# Altium schematic sheet Deel_1_ATMEGA.SchDoc: Soldeerstation
size A4; CompanyName: PXL; DrawnBy: Kenneth Rennen; Revision: 1.0; SheetNumber: 1; SheetTotal: 5; Scheet of: 1/5; Number: PXL_1EAI_12102667
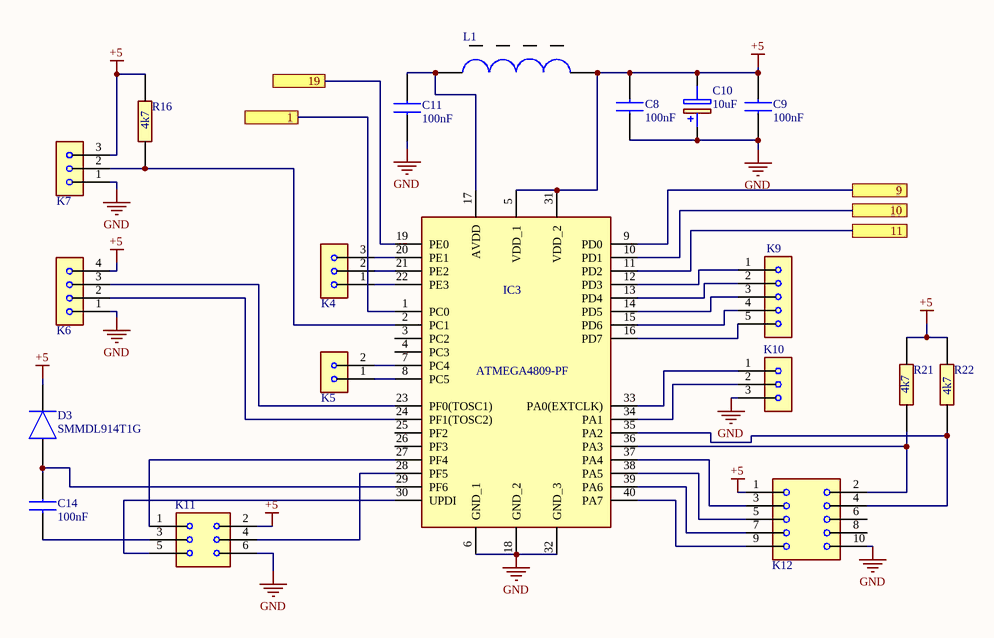
[diagram p0: Deel_1_ATMEGA.SchDoc]

## Parts
C8  100nF  [100nF]
C9  100nF  [100nF]
C10  10uF  [10uf]
C11  100nF  [100nF]
C14  100nF  [100nF]
D3  SMMDL914T1G  [smmdl914]
IC3  ATMEGA4809-PF  [ATMEGA4809-PF]
K4  1x3header  [HDR1X3]  (value not drawn)
K5  1x2header  [HDR1X2]  (value not drawn)
K6  1x4header  [HDR1X4]  (value not drawn)
K7  1x3header  [HDR1X3]  (value not drawn)
K9  1x5header  [HDR1X5]  (value not drawn)
K10  1x3header  [HDR1X3]  (value not drawn)
K11  2x3header  [HDR2X3]  (value not drawn)
K12  10 boxheader  [10BoxHeader]  (value not drawn)
L1  smoorspoel  [smoorspoel]  (value not drawn)
R16  4k7  [4k7]
R21  4k7  [4k7]
R22  4k7  [4k7]

## Ports
1, 9, 10, 11, 19

## Nets
+5: C8.2 C9.2 C10.2(-) D3.1(K) IC3.5(VDD_1) IC3.31(VDD_2) K6.4 K7.3 K11.2 K12.1 L1.2 R16.2 R21.2 R22.2
GND: C8.1 C9.1 C10.1(+) C11.1 IC3.6(GND_1) IC3.18(GND_2) IC3.32(GND_3) K6.1 K7.1 K10.3 K11.6 K12.10
1: IC3.1(PC0) ; port 1
9: IC3.9(PD0) ; port 9
10: IC3.10(PD1) ; port 10
11: IC3.11(PD2) ; port 11
19: IC3.19(PE0) ; port 19
NetC11_2: C11.2 IC3.17(AVDD) L1.1
NetC14_1: C14.1 K11.3
NetC14_2: C14.2 D3.2(A) IC3.29(PF6)
NetIC3_2: IC3.2(PC1) K7.2 R16.1
NetIC3_7: IC3.7(PC4) K5.2
NetIC3_8: IC3.8(PC5) K5.1
NetIC3_12: IC3.12(PD3) K9.1
NetIC3_13: IC3.13(PD4) K9.2
NetIC3_14: IC3.14(PD5) K9.3
NetIC3_15: IC3.15(PD6) K9.4
NetIC3_16: IC3.16(PD7) K9.5
NetIC3_20: IC3.20(PE1) K4.3
NetIC3_21: IC3.21(PE2) K4.2
NetIC3_22: IC3.22(PE3) K4.1
NetIC3_23: IC3.23(PF0(TOSC1)) K6.3
NetIC3_24: IC3.24(PF1(TOSC2)) K6.2
NetIC3_27: IC3.27(PF4) K11.1
NetIC3_28: IC3.28(PF5) K11.4
NetIC3_30: IC3.30(UPDI) K11.5
NetIC3_33: IC3.33(PA0(EXTCLK)) K10.1
NetIC3_34: IC3.34(PA1) K10.2
NetIC3_35: IC3.35(PA2) K12.4 R22.1
NetIC3_36: IC3.36(PA3) K12.2 R21.1
NetIC3_37: IC3.37(PA4) K12.3
NetIC3_38: IC3.38(PA5) K12.5
NetIC3_39: IC3.39(PA6) K12.7
NetIC3_40: IC3.40(PA7) K12.9

Not connected (* = marked no-connect by the designer): IC3 3(PC2) 4(PC3) 25(PF2) 26(PF3); K12 6 8

## Library data of the parts
C8 C9 C11 C14 = 100nF: Capacitor; Manufacturer_Name: AVX; Manufacturer_Part_Number: 0402YC104MAT2A; Datasheet Link: http://www.mouser.com/catalog/supplier/library/pdf/AVXSurfaceMountCeramic.pdf; Height: 0.56mm; Mouser Part Number: 581-0402YC104MAT2A; Mouser Price/Stock: https://www.mouser.co.uk/ProductDetail/AVX/0402YC104MAT2A?qs=O2%2FeDh0sX9yiCaLwpXy1bw%3D%3D
C10 = 10uF: Capacitor Polarised 860020672010; Manufacturer_Name: Wurth Elektronik; Datasheet Link: https://componentsearchengine.com//860020672010.pdf; Height: 12.5mm; Mouser2 Part Number: 710-860020672010; Mouser2 Price/Stock: https://www.mouser.com/Search/Refine.aspx?Keyword=710-860020672010; Manufacturer_Part_Number: 860020672010
D3 = SMMDL914T1G: Diode SMMDL914T1G; Manufacturer_Name: ON Semiconductor; Datasheet Link: https://componentsearchengine.com//SMMDL914T1G.pdf; Height: 1.1mm; Mouser2 Part Number: 863-SMMDL914T1G; Mouser2 Price/Stock: https://www.mouser.com/Search/Refine.aspx?Keyword=863-SMMDL914T1G; Manufacturer_Part_Number: SMMDL914T1G
IC3 = ATMEGA4809-PF: Integrated Circuit; Manufacturer_Name: Microchip; Datasheet Link: http://ww1.microchip.com/downloads/en/DeviceDoc/40-pin-Data-Sheet-megaAVR-0-series-DS40002104A.pdf; Height: 6.35mm; Manufacturer_Part_Number: ATMEGA4809-PF; Mouser Part Number: 556-ATMEGA4809-PF; Mouser Price/Stock: https://www.mouser.co.uk/ProductDetail/Microchip-Technology-Atmel/ATMEGA4809-PF?qs=T3oQrply3y9UlpZbCygk%252BQ%3D%3D
K4 K7 K10 = 1x3header: Connector; Manufacturer_Name: Molex; Manufacturer_Part_Number: 0022035035; Datasheet Link: https://www.molex.com/pdm_docs/sd/022035035_sd.pdf; Height: 6.1mm; Mouser Part Number: N/A; Mouser Price/Stock: https://www.mouser.co.uk/ProductDetail/Molex/0022035035?qs=PBcRNPEHKsp8%252BOnk6fhZPA%3D%3D; Arrow Part Number: 0022035035; Arrow Price/Stock: https://www.arrow.com/en/products/0022035035/molex
K5 = 1x2header: Connector; Manufacturer_Name: Molex; Manufacturer_Part_Number: 0022232021; Datasheet Link: https://www.molex.com/webdocs/datasheets/pdf/en-us//0022232021_PCB_HEADERS.pdf; Height: 11.05mm; Mouser Part Number: N/A; Mouser Price/Stock: https://www.mouser.co.uk/ProductDetail/Molex/0022232021?qs=PBcRNPEHKspVhuxYRaP9bQ%3D%3D; Arrow Part Number: 0022232021; Arrow Price/Stock: https://www.arrow.com/en/products/0022232021/molex?region=europe
K6 = 1x4header: Connector; Manufacturer_Name: Molex; Manufacturer_Part_Number: 0009652048; Datasheet Link: https://www.molex.com/pdm_docs/sd/009652048_sd.pdf; Height: 14.25mm; Mouser Part Number: N/A; Mouser Price/Stock: https://www.mouser.co.uk/ProductDetail/Molex/0009652048?qs=PBcRNPEHKsr%252BMEGD33m%2F9w%3D%3D; Arrow Part Number: 0009652048; Arrow Price/Stock: https://www.arrow.com/en/products/0009652048/molex?region=europe
K9 = 1x5header: Connector; Manufacturer_Name: Molex; Manufacturer_Part_Number: 0353620550; Datasheet Link: https://www.molex.com/pdm_docs/sd/353620550_sd.pdf; Height: 8.5mm; Mouser Part Number: N/A; Mouser Price/Stock: https://www.mouser.com/Search/Refine.aspx?Keyword=N%2FA; Arrow Part Number: 0353620550; Arrow Price/Stock: https://www.arrow.com/en/products/0353620550/molex
K11 = 2x3header: Connector; Manufacturer_Name: Amphenol; Manufacturer_Part_Number: 10129381-906002BLF; Datasheet Link: https://componentsearchengine.com/Datasheets/1/10129381-906002BLF.pdf; Height: 8.58mm; Mouser Part Number: 649-1012938190602BLF; Mouser Price/Stock: https://www.mouser.co.uk/ProductDetail/Amphenol-FCI/10129381-906002BLF?qs=DXv0QSHKF4zSKXKyBbBVMw%3D%3D; Arrow Part Number: 10129381-906002BLF; Arrow Price/Stock: https://www.arrow.com/en/products/10129381-906002blf/amphenol-fci?region=europe
K12 = 10 boxheader: Connector; Manufacturer_Name: Molex; Manufacturer_Part_Number: 0010897100; Datasheet Link: http://www.molex.com/pdm_docs/sd/010897100_sd.pdf; Height: 8.64mm; Mouser Part Number: N/A; Mouser Price/Stock: https://www.mouser.co.uk/ProductDetail/Molex/0010897100?qs=PBcRNPEHKsqIDCZzUxhahw%3D%3D; Arrow Part Number: 0010897100; Arrow Price/Stock: https://www.arrow.com/en/products/0010897100/molex?region=nac
L1 = smoorspoel: Inductor VLS6045EX-100M-H; Manufacturer_Name: TDK; Datasheet Link: https://componentsearchengine.com//VLS6045EX-100M-H.pdf; Mouser2 Part Number: 810-VLS6045EX-100M-H; Mouser2 Price/Stock: https://www.mouser.com/Search/Refine.aspx?Keyword=810-VLS6045EX-100M-H; Manufacturer_Part_Number: VLS6045EX-100M-H
R16 R21 R22 = 4k7: Resistor; Manufacturer_Name: TE Connectivity; Manufacturer_Part_Number: CPF0805B100RE1; Datasheet Link: https://datasheet.datasheetarchive.com/originals/distributors/DKDS-21/401696.pdf; Height: 0.65mm; Mouser Part Number: 279-CPF0805B100RE1; Mouser Price/Stock: https://www.mouser.co.uk/ProductDetail/TE-Connectivity-Holsworthy/CPF0805B100RE1?qs=9ylKvqdyudkCWLPT1QvLZQ%3D%3D; Arrow Part Number: CPF0805B100RE1; Arrow Price/Stock: https://www.arrow.com/en/products/cpf0805b100re1/te-connectivity?region=nac